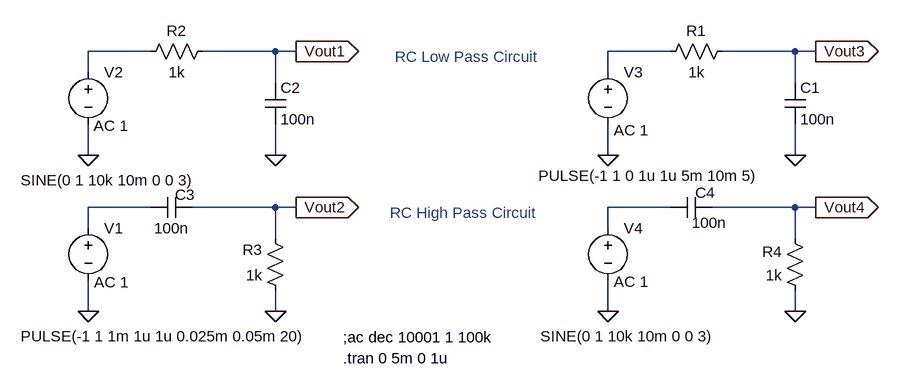
[diagram p0: schematic RC.asc]
RC.asc, the LTspice schematic file:
Version 4
SHEET 1 1232 680
WIRE 80 -160 -16 -160
WIRE 272 -160 160 -160
WIRE 304 -160 272 -160
WIRE 880 -160 784 -160
WIRE 1072 -160 960 -160
WIRE 1104 -160 1072 -160
WIRE -16 -128 -16 -160
WIRE 784 -128 784 -160
WIRE 272 -112 272 -160
WIRE 1072 -112 1072 -160
WIRE -16 0 -16 -48
WIRE 272 0 272 -48
WIRE 784 0 784 -48
WIRE 1072 0 1072 -48
WIRE 80 80 -16 80
WIRE 272 80 144 80
WIRE 304 80 272 80
WIRE 880 80 784 80
WIRE 1072 80 944 80
WIRE 1104 80 1072 80
WIRE -16 112 -16 80
WIRE 784 112 784 80
WIRE 272 128 272 80
WIRE 1072 128 1072 80
WIRE -16 240 -16 192
WIRE 272 240 272 208
WIRE 784 240 784 192
WIRE 1072 240 1072 208
FLAG -16 240 0
FLAG 272 240 0
FLAG -16 0 0
FLAG 272 0 0
FLAG 304 -160 Vout1
IOPIN 304 -160 Out
FLAG 304 80 Vout2
IOPIN 304 80 Out
FLAG 784 0 0
FLAG 1072 0 0
FLAG 1104 -160 Vout3
IOPIN 1104 -160 Out
FLAG 784 240 0
FLAG 1072 240 0
FLAG 1104 80 Vout4
IOPIN 1104 80 Out
SYMBOL voltage -16 96 R0
WINDOW 3 -104 182 Left 2
WINDOW 123 9 99 Left 2
WINDOW 39 0 0 Left 2
SYMATTR Value PULSE(-1 1 1m 1u 1u 0.025m 0.05m 20)
SYMATTR Value2 AC 1
SYMATTR InstName V1
SYMBOL cap 256 -112 R0
SYMATTR InstName C2
SYMATTR Value 100n
SYMBOL res 176 -176 R90
WINDOW 0 0 56 VBottom 2
WINDOW 3 32 56 VTop 2
SYMATTR InstName R2
SYMATTR Value 1k
SYMBOL voltage -16 -144 R0
WINDOW 3 -104 182 Left 2
WINDOW 123 8 98 Left 2
WINDOW 39 0 0 Left 2
SYMATTR Value SINE(0 1 10k 10m 0 0 3)
SYMATTR Value2 AC 1
SYMATTR InstName V2
SYMBOL res 288 224 R180
WINDOW 0 36 79 Left 2
WINDOW 3 36 40 Left 2
SYMATTR InstName R3
SYMATTR Value 1k
SYMBOL cap 144 64 R90
WINDOW 0 12 11 VBottom 2
WINDOW 3 32 32 VTop 2
SYMATTR InstName C3
SYMATTR Value 100n
SYMBOL cap 1056 -112 R0
SYMATTR InstName C1
SYMATTR Value 100n
SYMBOL res 976 -176 R90
WINDOW 0 0 56 VBottom 2
WINDOW 3 32 56 VTop 2
SYMATTR InstName R1
SYMATTR Value 1k
SYMBOL voltage 784 -144 R0
WINDOW 3 -107 175 Left 2
WINDOW 123 9 105 Left 2
WINDOW 39 0 0 Left 2
SYMATTR Value PULSE(-1 1 0 1u 1u 5m 10m 5)
SYMATTR Value2 AC 1
SYMATTR InstName V3
SYMBOL voltage 784 96 R0
WINDOW 3 -104 182 Left 2
WINDOW 123 9 98 Left 2
WINDOW 39 0 0 Left 2
SYMATTR Value SINE(0 1 10k 10m 0 0 3)
SYMATTR Value2 AC 1
SYMATTR InstName V4
SYMBOL res 1088 224 R180
WINDOW 0 36 76 Left 2
WINDOW 3 36 40 Left 2
SYMATTR InstName R4
SYMATTR Value 1k
SYMBOL cap 944 64 R90
WINDOW 0 9 10 VBottom 2
WINDOW 3 24 4 VTop 2
SYMATTR InstName C4
SYMATTR Value 100n
TEXT 376 312 Left 2 !.tran 0 5m 0 1u
TEXT 376 280 Left 2 !;ac dec 10001 1 100k
TEXT 456 -152 Left 2 ;RC Low Pass Circuit
TEXT 448 88 Left 2 ;RC High Pass Circuit

The netlist it stands for:
* RC.asc
V1 N003 0 PULSE(-1 1 1m 1u 1u 0.025m 0.05m 20) AC 1
C2 Vout1 0 100n
R2 Vout1 N001 1k
V2 N001 0 SINE(0 1 10k 10m 0 0 3) AC 1
R3 0 Vout2 1k
C3 Vout2 N003 100n
C1 Vout3 0 100n
R1 Vout3 N002 1k
V3 N002 0 PULSE(-1 1 0 1u 1u 5m 10m 5) AC 1
V4 N004 0 SINE(0 1 10k 10m 0 0 3) AC 1
R4 0 Vout4 1k
C4 Vout4 N004 100n
.tran 0 5m 0 1u
;ac dec 10001 1 100k
* RC Low Pass Circuit
* RC High Pass Circuit
.backanno
.end